# EAGLE design power_sml_pcb (EAGLE 6.3)
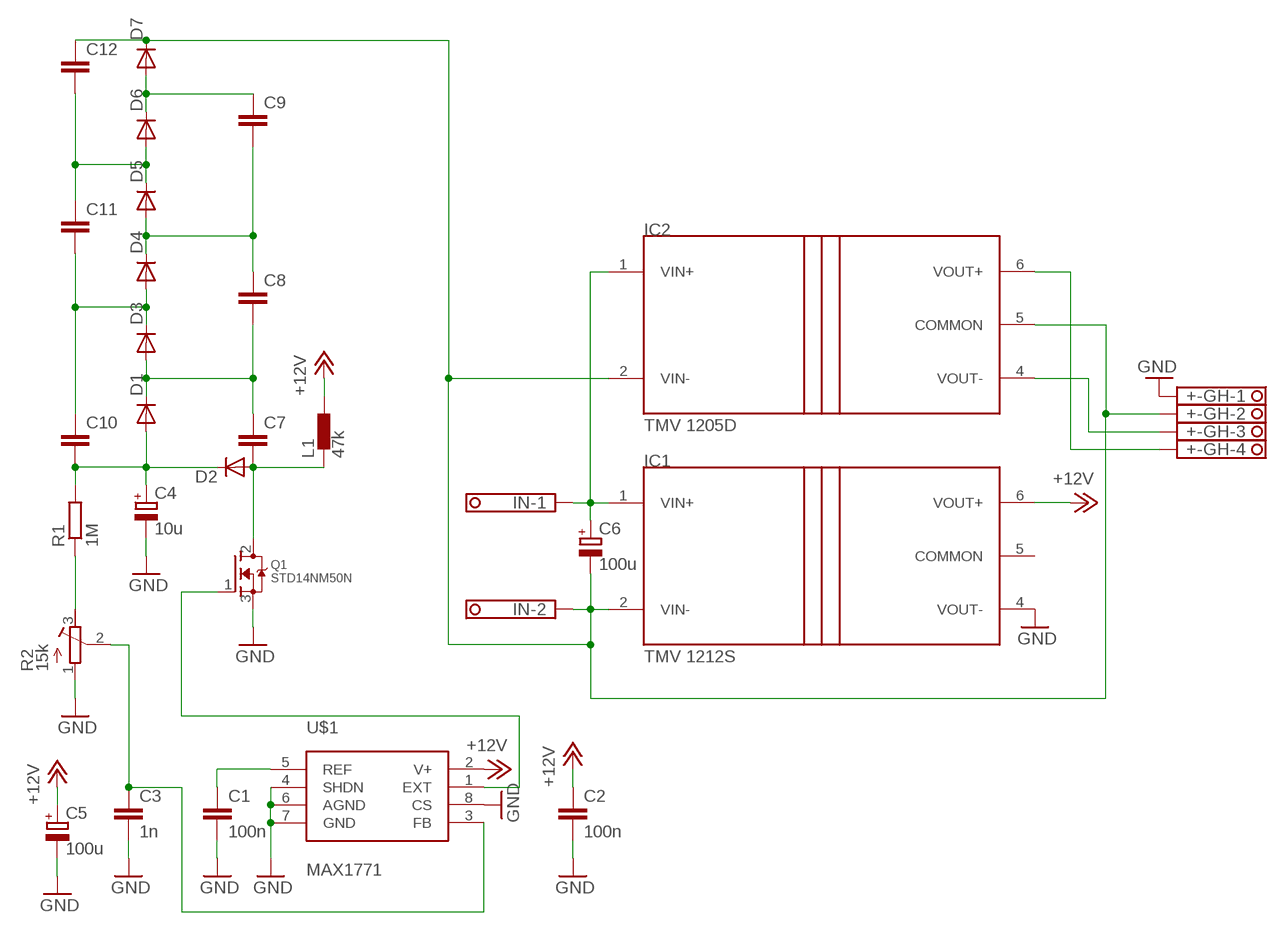
[diagram p0: schematic, sheet 1]

## Parts
+-GH  1751264  [1751264]
C1  100n  C-EUC0603  [C0603]
C2  100n  C-EUC0603  [C0603]
C3  1n  C-EUC0603  [C0603]
C4  10u  CPOL-EUE5-10.5  [E5-10,5]
C5  100u  CPOL-EUSMCC  [SMC_C]
C6  100u  CPOL-EUE2.5-6  [E2,5-6]
C7  C-EU102-054X133  [C102-054X133]
C8  C-EU102-054X133  [C102-054X133]
C9  C-EU102-054X133  [C102-054X133]
C10  C-EU102-054X133  [C102-054X133]
C11  C-EU102-054X133  [C102-054X133]
C12  C-EU102-054X133  [C102-054X133]
D1  DIODE-DO214AA  [DO214AA]
D2  DIODE-DO214AA  [DO214AA]
D3  DIODE-DO214AA  [DO214AA]
D4  DIODE-DO214AA  [DO214AA]
D5  DIODE-DO214AA  [DO214AA]
D6  DIODE-DO214AA  [DO214AA]
D7  DIODE-DO214AA  [DO214AA]
IC1  TMV 1212S  TMA1212S  [SIP7]
IC2  TMV 1205D  TMA0505D  [SIP7]
IN  1751248  [1751248]
L1  47k  DR1030  [DR1030]
Q1  STD14NM50N  NFET_DPAK  [DPAK]
R1  1M  R-EU_0207/7  [0207/7]
R2  15k  R-TRIMM3296W  [RTRIM3296W]
U$1  MAX1771  MAX1771-SOIC8  [SOIC8]

## Nets
+12V: C2.1 C5.+ IC1.6(VOUT+) L1.2 U$1.2(V+)
GND: +-GH.1 C1.2 C2.2 C3.2 C4.- C5.- IC1.4(VOUT-) Q1.3(S) R2.1(E) U$1.4(SHDN) U$1.6(AGND) U$1.7(GND) U$1.8(CS)
N$1: C1.1 U$1.5(REF)
N$2: C3.1 R2.2(S) U$1.3(FB)
N$3: Q1.1(G) U$1.1(EXT)
N$4: C7.2 D2.A L1.1 Q1.2(D)
N$5: C4.+ C10.2 D1.A D2.C R1.2
N$6: R1.1 R2.3(A)
N$7: C6.+ IC1.1(VIN+) IC2.1(VIN+) IN.1
N$9: +-GH.4 IC2.6(VOUT+)
N$10: +-GH.3 IC2.4(VOUT-)
N$12: +-GH.2 C6.- C12.1 D7.C IC1.2(VIN-) IC2.2(VIN-) IC2.5(COMMON) IN.2
N$14: C7.1 C8.2 D1.C D3.A
N$15: C10.1 C11.2 D3.C D4.A
N$16: C8.1 C9.2 D4.C D5.A
N$17: C11.1 C12.2 D5.C D6.A
N$18: C9.1 D6.C D7.A

## Power pins joined to a net without a drawn wire
COMMON: IC1.5(COMMON)

## Library data of the parts
+-GH = con-phoenix-350:1751264: MKDS 1/ 4-3,5 Printklemme Nennstrom: 10 A Bemessungsspannung: 160 V Raster: 3,5 mm Polzahl: 4 Montageart: Löten Anschlussart: Schraubanschluss Anschlussrichtung vom Leiter zur Platine: 0° Source: http://eshop.phoenixcontact.com .. 1751264.pdf; MPN: 1751264; OC_FARNELL: unknown; OC_NEWARK: 10R0934
C1-C3 C7-C12 = resistor:C-EU: CAPACITOR, European symbol
C4-C6 = resistor:CPOL-EU: POLARIZED CAPACITOR, European symbol
D1-D7 = diode:DIODE-: DIODE
IC1 IC2 = traco_tma:TMA: Traco Power TMA Series DC/DC Converter
IN = con-phoenix-350:1751248: MKDS 1/ 2-3,5 Printklemme Nennstrom: 10 A Bemessungsspannung: 160 V Raster: 3,5 mm Polzahl: 2 Montageart: Löten Anschlussart: Schraubanschluss Anschlussrichtung vom Leiter zur Platine: 0° Source: http://eshop.phoenixcontact.com .. 1751248.pdf; OC_FARNELL: unknown; OC_NEWARK: unknown
L1 = inductors:DR1030: DR1030 Series Low Profile Power Inductors Source: Data sheet <http://www.cooperbussmann.com/pdf/c73e479f-f867-4c64-ae26-9c1f23814163.pdf>
Q1 = fet:NFET: N-Channel Mosfet (2N7002)
R1 = resistor:R-EU_: RESISTOR, European symbol
R2 = resistor:R-TRIMM: Trimm resistor
U$1 = poweric:MAX1771

## Board
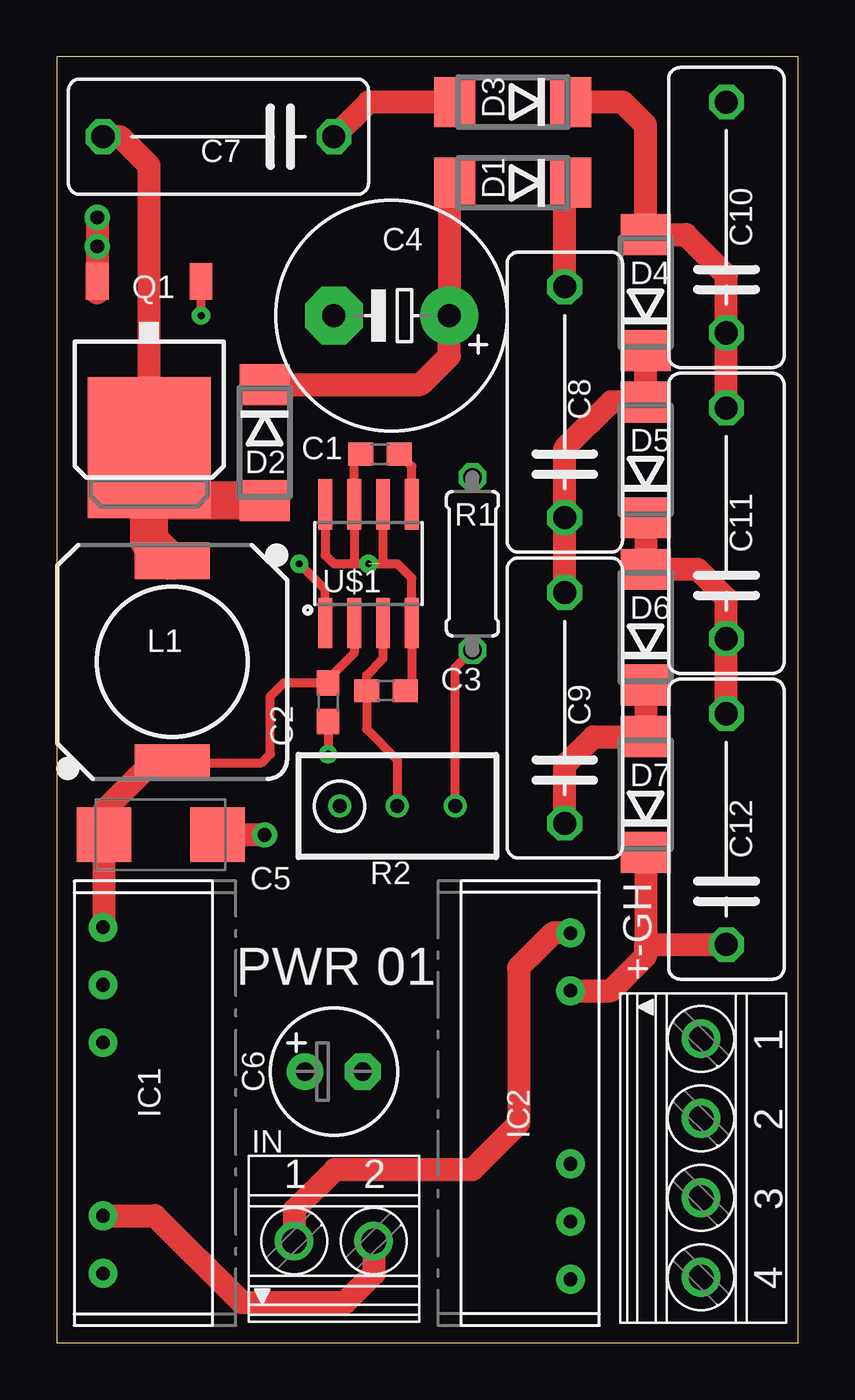
[diagram p1: board, top side]
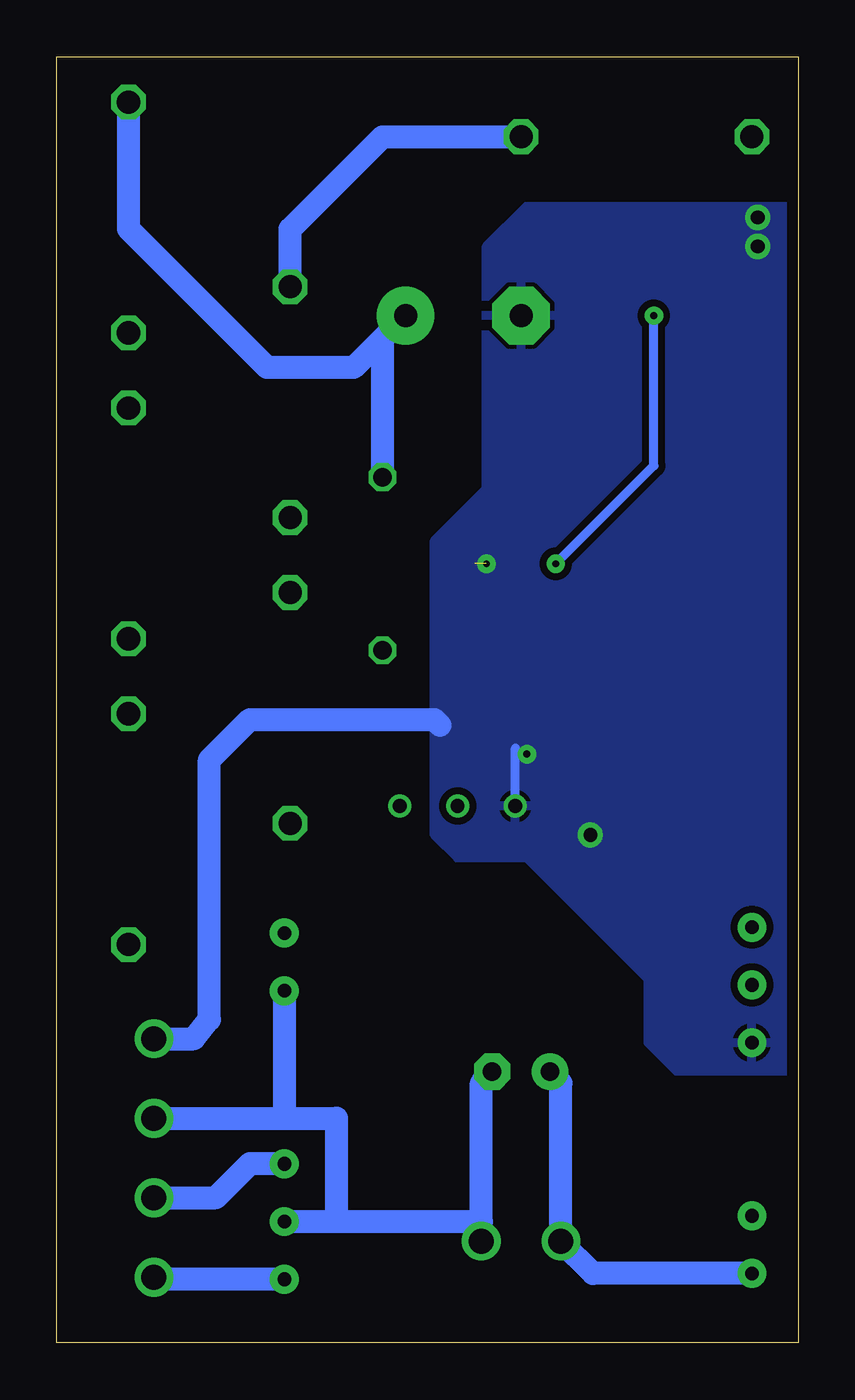
[diagram p2: board, bottom side, seen from below]

Size 32.62 x 56.6 mm. Coordinates in mm from the lower left corner, seen from the top.
Outline: 0,0 32.62,0 32.62,56.6 0,56.6 0,0
Copper layers (1*16): Top 0.035mm / dielectric 1.5mm / Bottom 0.035mm
Design rules "PCBCart-proto": minimum track width 5mil, minimum drill 0.2mm, track to track 6mil, track to pad 6mil, pad to pad 6mil, via to via 6mil, smd to smd 5mil, copper to edge 20mil, drill to drill 8mil, minimum pad ring 8mil, minimum via ring 10mil, stop-mask expansion 3mil, vias tented up to drill 0mil, thermal gap 8mil

### Footprints (pad centres in the part's own frame; a part is rotated, then mirrored left to right if it is on the bottom)
1751264 = drill 1.1 pad 1.7: 1 -5.25,-0.1; 2 -1.75,-0.1; 3 1.75,-0.1; 4 5.25,-0.1
C0603 = smd 1.1 x 1: 1 -0.85,0; 2 0.85,0
E5-10,5 = drill 1.016 pad 2.54: + -2.54,0 | drill 1.016 pad 2.54 octagon: - 2.54,0
SMC_C = smd 2.4 x 2.4: + -2.5,0; - 2.5,0
E2,5-6 = drill 0.813 pad 1.6: + -1.27,0 | drill 0.813 pad 1.6 octagon: - 1.27,0
C102-054X133 = drill 1.016 octagon: 1 -5.08,0; 2 5.08,0
DO214AA = smd 1.8 x 2.2: A 2.55,0; C -2.55,0
SIP7 = drill 0.6 pad 1.27: 1 -7.874,2.286; 2 -5.334,2.286; 4 2.286,2.286; 5 4.826,2.286; 6 7.366,2.286
1751248 = drill 1.1 pad 1.7: 1 -1.75,-0.1; 2 1.75,-0.1
DR1030 = smd 3.3 x 1.6: 1 0,4.45; 2 0,-4.45
DPAK = smd 1 x 1.6: 1 -2.28,-4.8; 3 2.28,-4.8 | smd 5.4 x 6.2: 2 0,2.5
0207/7 = drill 0.813 octagon: 1 -3.81,0; 2 3.81,0
RTRIM3296W = drill 0.61: 1 0,-2.54; 2 0,0; 3 0,2.54
SOIC8 = smd 0.61 x 2.21: 1 -1.905,-2.616; 2 -0.635,-2.616; 3 0.635,-2.616; 4 1.905,-2.616; 5 1.905,2.616; 6 0.635,2.616; 7 -0.635,2.616; 8 -1.905,2.616

### Placement (x,y rotation side)
+-GH  28.45,8.13 270 top
C1  14.22,39.12 180 top
C2  11.94,28.19 270 top
C3  14.48,28.7 0 top
C4  14.73,45.21 180 top
C5  4.57,22.35 0 top
C6  12.19,11.94 0 top
C7  7.11,53.09 180 top
C8  22.35,41.4 90 top
C9  22.35,27.94 90 top
C10  29.46,49.53 90 top
C11  29.46,36.07 90 top
C12  29.46,22.61 90 top
D1  20.07,51.05 180 top
D2  9.14,39.62 270 top
D3  20.07,54.61 180 top
D4  25.91,46.23 90 top
D5  25.91,38.86 90 top
D6  25.91,31.5 90 top
D7  25.91,24.13 90 top
IC1  4.32,10.92 90 top
IC2  20.32,10.16 270 top
IN  12.19,4.57 0 top
L1  5.08,29.97 0 top
Q1  4.06,41.91 180 top
R1  18.29,34.29 90 top
R2  14.99,23.62 270 top
U$1  13.72,34.29 0 top

### Tracks (layer width: path | path; a pad name or v marks a point on that pad's centre or on a via)
+12V
  Top 0.406: U$1.2 13.08,30.35 11.77,29.04 | L1.2 9.01,25.52 9.4,25.91 9.4,28.45 9.99,29.04 11.77,29.04 | C2.1 11.77,29.04
  Top 1.016: IC1.6 2.07,18.33 C5.+ 2.07,23.41 4.19,25.52 L1.2
GND  (via drill 0.3, 0.6)  (1 unrouted)
  Top 0.406: C3.2 15.62,29 U$1.4 15.62,33.66 14.99,34.29 14.22,34.29 | U$1.8 11.81,34.67 12.19,34.29 12.95,34.29 | 12.95,34.29 14.22,34.29 | U$1.6 14.35,34.42 14.22,34.29 | 12.95,34.29 13.08,34.42 U$1.7 13.08,38.82 C1.2 | C2.2 v11.94,25.91
  Top 1.016: v1.78,49.53 1.78,46.21 Q1.3 | v9.14,22.35 C5.-
  Bottom 0.406: R2.1 12.45,26.16
  Bottom 1.016: +-GH.1 26.59,13.38 25.91,14.22 25.91,25.65 24.13,27.43 16,27.43 15.75,27.18
  other vias: 13.72,34.29 1.78,48.26
  pour Bottom (isolate 0.305): -0.51,50.04 -0.51,25.91 -0.51,25.91 -0.51,11.94 5.33,11.94 6.6,13.21 6.6,16 11.94,21.34 14.99,21.34 16,22.35 16,35.31 13.72,37.59 13.72,48.26 11.94,50.04
N$1
  Top 0.406: U$1.5 15.62,38.57 C1.1
N$2
  Top 0.406: U$1.3 14.35,30.1 13.63,29.38 C3.1 13.63,27.01 14.99,25.65 R2.2
N$3  (via drill 0.3)
  Top 0.406: U$1.1 11.81,33.15 v10.67,34.29 | v6.35,45.21 6.35,46.21 Q1.1
  Bottom 0.406: v10.67,34.29 6.35,38.61 v6.35,45.21
N$4
  Top 1.016: Q1.2 4.06,51.82 2.79,53.09 C7.2
  Top 1.676: L1.1 4.95,34.42 4.06,35.31 Q1.2 4.11,37.07 D2.A
N$5
  Top 1.016: D2.C 16.01,42.17 17.27,43.43 C4.+ 17.27,48.51 17.26,50.81 D1.A
  Bottom 1.016: C10.2 29.46,49.02 23.37,42.93 19.56,42.93 18.29,44.2 | R1.2 18.29,44.2 | C4.+ 18.29,44.2
N$6
  Top 0.406: R2.3 17.53,29.72 R1.1
N$7
  Top 1.016: IC2.1 21.84,18.03 20.32,16.51 20.32,9.65 18.29,7.62 12.22,7.62 10.44,5.84 IN.1
  Bottom 1.016: C6.+ 10.44,11.43 IN.1 9.02,3.05 IC1.1
N$9
  Bottom 1.016: IC2.6 28.35,2.79 +-GH.4
N$10
  Bottom 1.016: IC2.4 24.13,7.87 25.63,6.38 +-GH.3
N$12
  Top 1.016: IN.2 13.97,4.44 13.97,3.05 12.7,1.78 8.13,1.78 4.32,5.59 IC1.2 | IC2.2 24.38,15.49 25.91,17.02 25.91,17.53 | 25.91,17.53 C12.1 | D7.C 25.91,17.53
  Bottom 1.016: IN.2 13.94,5.33 | 13.94,5.33 13.94,11.43 C6.- | IC2.5 20.32,5.33 | 20.32,5.33 13.94,5.33 | +-GH.2 22.61,9.88 | 22.61,9.88 20.32,9.88 20.32,5.33 | IC2.2 22.61,9.88
N$14
  Top 1.016: C8.2 22.35,51.06 D1.C | D3.A 13.72,54.61 C7.1
  Bottom 1.016: C8.2 22.35,49.02 18.29,53.09 C7.1
N$15
  Top 1.016: C11.2 C10.1 29.46,46.99 27.68,48.78 D4.A 25.91,53.59 24.89,54.61 D3.C
N$16
  Top 1.016: C9.2 C8.1 22.35,39.37 24.39,41.41 D5.A D4.C
N$17
  Top 1.016: C12.2 C11.1 29.46,32.77 28.18,34.05 D6.A D5.C
N$18
  Top 1.016: D6.C D7.A | 25.65,26.42 D7.A | C9.1 22.35,25.4 23.62,26.67 25.9,26.67 D7.A

### Text on the board
tNames: PWR 01